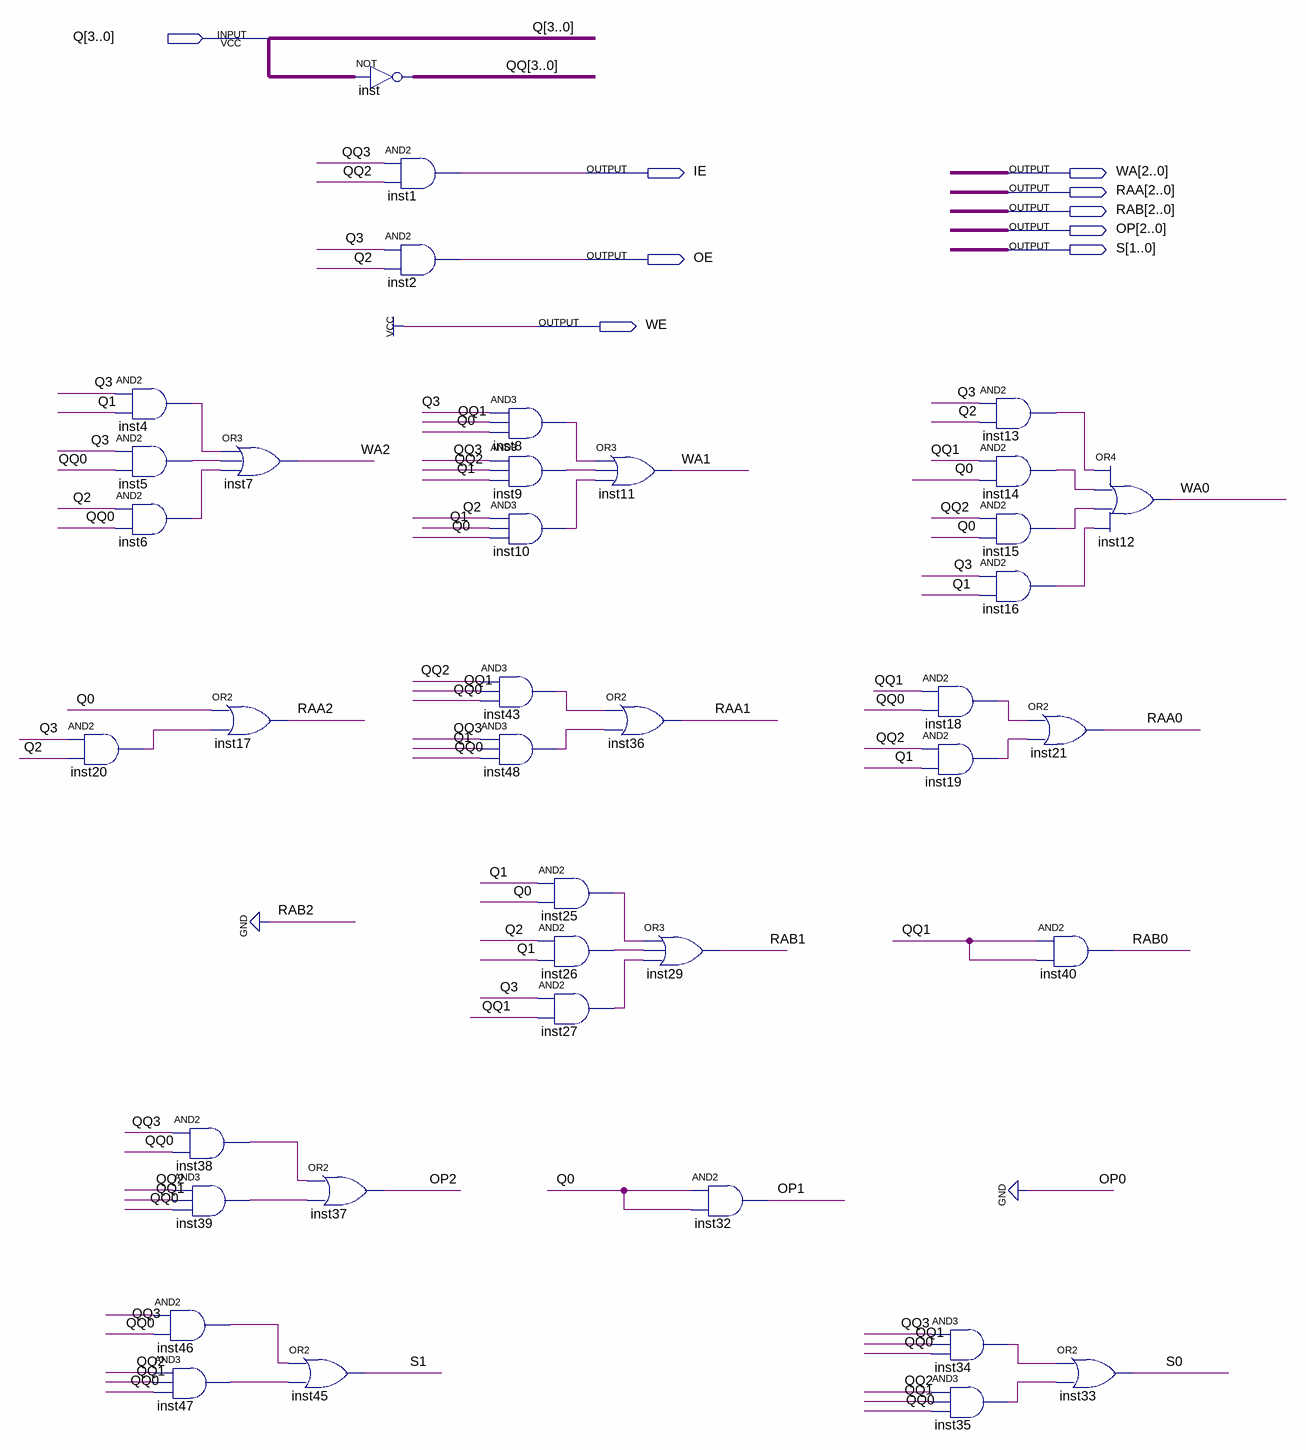
[diagram p0: schematic sheet]
// Quartus schematic MAHOA.bdf as structural Verilog: 39 symbols, 9 pins
module MAHOA (
  input  [3:0] Q,
  output IE,
  output [2:0] WA,
  output [2:0] RAA,
  output [2:0] RAB,
  output [2:0] OP,
  output [1:0] S,
  output OE,
  output WE
);

  wire inst4_out, inst5_out, inst6_out, inst8_out, inst9_out, inst10_out, inst13_out, inst14_out, inst15_out,
       inst16_out, inst18_out, inst19_out, inst20_out, inst25_out, inst26_out, inst27_out, inst34_out,
       inst35_out, inst38_out, inst39_out, inst43_out, inst46_out, inst47_out, inst48_out;
  wire [3:0] QQ;

  and inst4 (inst4_out, Q[3], Q[1]);
  and inst5 (inst5_out, Q[3], QQ[0]);
  and inst6 (inst6_out, Q[2], QQ[0]);
  and inst20 (inst20_out, Q[3], Q[2]);
  or inst17 (RAA[2], Q[0], inst20_out);
  and inst38 (inst38_out, QQ[3], QQ[0]);
  and inst39 (inst39_out, QQ[2], QQ[1], QQ[0]);
  and inst46 (inst46_out, QQ[3], QQ[0]);
  and inst47 (inst47_out, QQ[2], QQ[1], QQ[0]);
  or inst7 (WA[2], inst4_out, inst5_out, inst6_out);
  or inst45 (S[1], inst46_out, inst47_out);
  assign QQ = ~Q;  // NOT inst, 4 bits wide
  or inst37 (OP[2], inst38_out, inst39_out);
  and inst1 (IE, QQ[3], QQ[2]);
  and inst2 (OE, Q[3], Q[2]);
  and inst8 (inst8_out, Q[3], QQ[1], Q[0]);
  and inst9 (inst9_out, QQ[3], QQ[2], Q[1]);
  and inst10 (inst10_out, Q[2], Q[1], Q[0]);
  and inst43 (inst43_out, QQ[2], QQ[1], QQ[0]);
  and inst48 (inst48_out, QQ[3], Q[1], QQ[0]);
  or inst11 (WA[1], inst8_out, inst9_out, inst10_out);
  and inst25 (inst25_out, Q[1], Q[0]);
  and inst26 (inst26_out, Q[2], Q[1]);
  and inst27 (inst27_out, Q[3], QQ[1]);
  or inst36 (RAA[1], inst43_out, inst48_out);
  or inst29 (RAB[1], inst25_out, inst26_out, inst27_out);
  and inst32 (OP[1], Q[0], Q[0]);
  and inst13 (inst13_out, Q[3], Q[2]);
  and inst14 (inst14_out, QQ[1], Q[0]);
  and inst15 (inst15_out, QQ[2], Q[0]);
  and inst16 (inst16_out, Q[3], Q[1]);
  and inst18 (inst18_out, QQ[1], QQ[0]);
  and inst19 (inst19_out, QQ[2], Q[1]);
  and inst34 (inst34_out, QQ[3], QQ[1], QQ[0]);
  and inst35 (inst35_out, QQ[2], QQ[1], QQ[0]);
  or inst21 (RAA[0], inst18_out, inst19_out);
  and inst40 (RAB[0], QQ[1], QQ[1]);
  or inst33 (S[0], inst34_out, inst35_out);
  or inst12 (WA[0], inst13_out, inst14_out, inst15_out, inst16_out);

  assign OP[0] = 1'b0;
  assign RAB[2] = 1'b0;
  assign WE = 1'b1;
endmodule
